# EAGLE design uio_l (EAGLE 6.4)
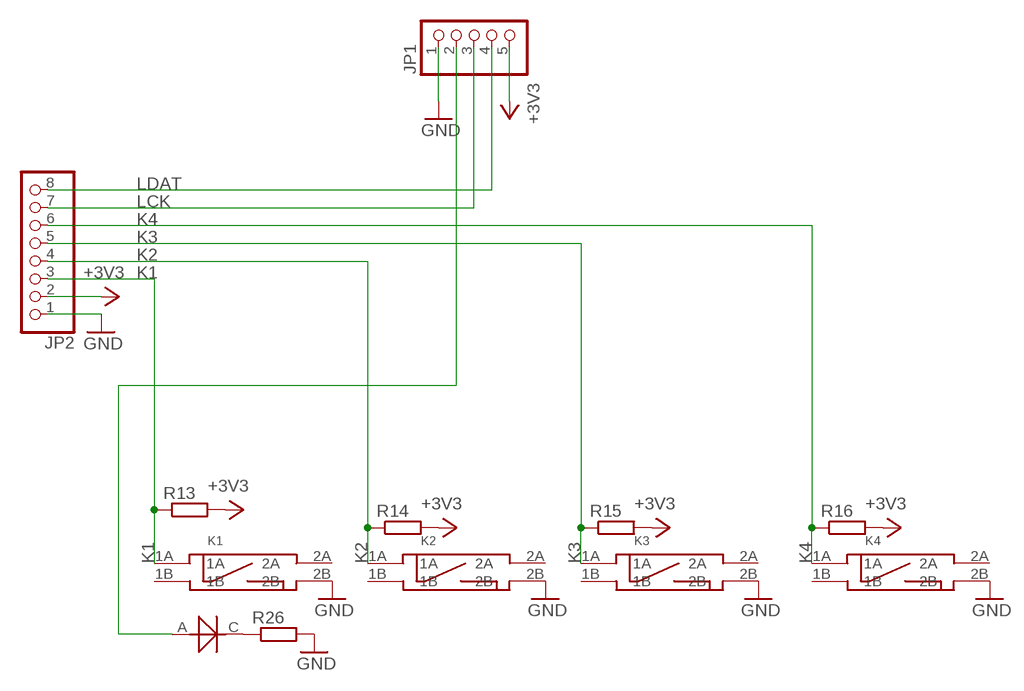
[diagram p0: schematic, sheet 1]

## Parts
JP1  PINHD-1X05_2.54-S  [1X05-S]
JP2  PINHD-1X08_2.54-S  [1X08-S]
K1  SWITCH_BD_B  [SW_SMD2]
K2  SWITCH_BD_B  [SW_SMD2]
K3  SWITCH_BD_B  [SW_SMD2]
K4  SWITCH_BD_B  [SW_SMD2]
R13  R_0805  [R0805]
R14  R_0805  [R0805]
R15  R_0805  [R0805]
R16  R_0805  [R0805]
R26  R_0805  [R0805]
U$14  LED5X2  [LED_5X2]

## Nets
+3V3: JP1.5 JP2.2 R13.2 R14.2 R15.2 R16.2
GND: JP1.1 JP2.1 K1.2B K2.2B K3.2B K4.2B R26.2
K1: JP2.3 K1.1A R13.1
K2: JP2.4 K2.1A R14.1
K3: JP2.5 K3.1A R15.1
K4: JP2.6 K4.1A R16.1
LCK: JP1.3 JP2.7
LDAT: JP1.4 JP2.8
LED11: JP1.2 U$14.A
N$11: R26.1 U$14.C
Unconnected: K1.1B K1.2A K2.1B K2.2A K3.1B K3.2A K4.1B K4.2A

## Library data of the parts
JP1 = pinhead-2:PINHD-1X05: PIN HEADER
JP2 = pinhead-2:PINHD-1X08: PIN HEADER
K1-K4 = _moja:SWITCH_BD
R13-R16 R26 = _moja:R
U$14 = _moja:LED

## Board
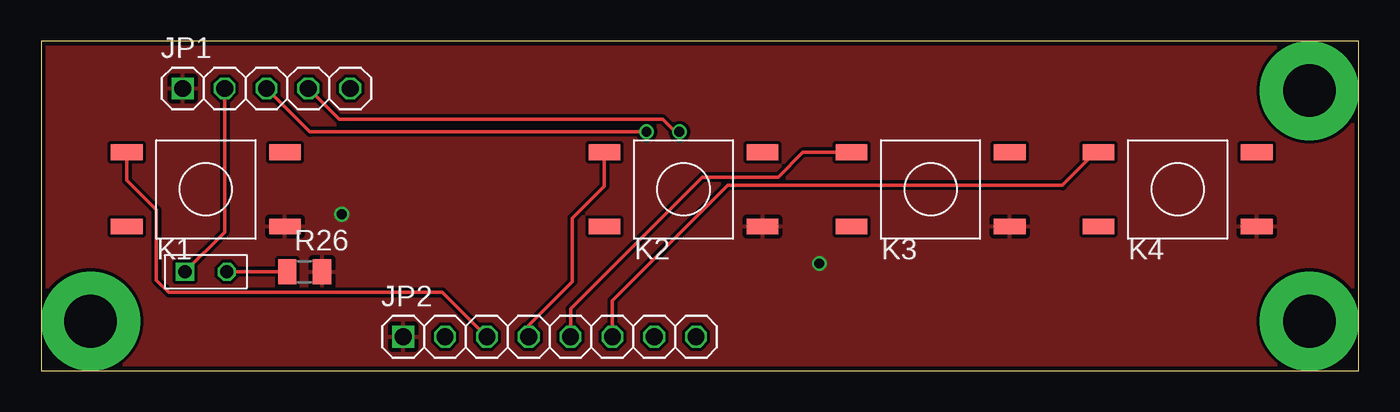
[diagram p1: board, top side]
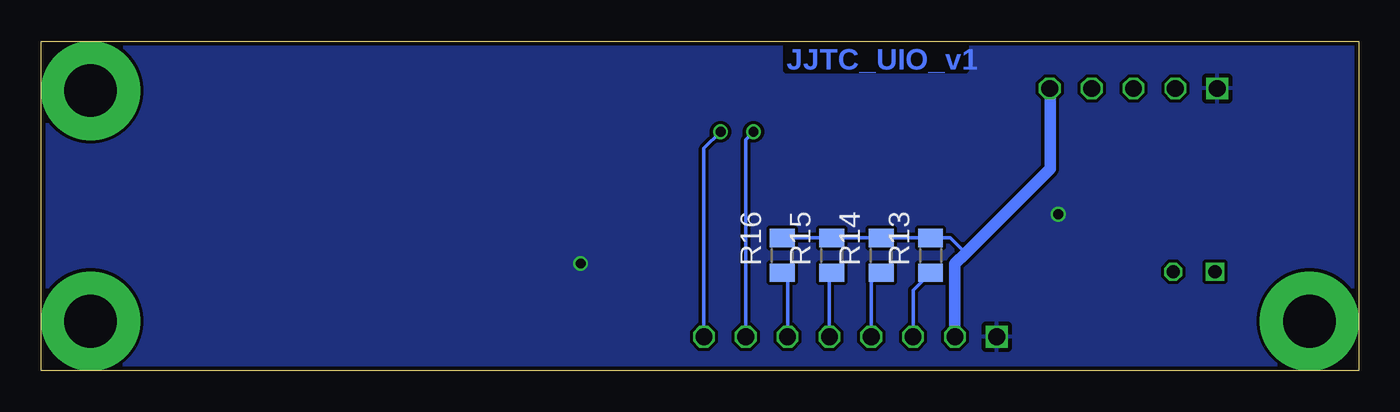
[diagram p2: board, bottom side, seen from below]

Size 80 x 20 mm. Coordinates in mm from the lower left corner, seen from the top.
Outline: 0,0 80,0 80,20 0,20 0,0
Copper layers (1*16): Top 0.035mm / dielectric 1.5mm / Bottom 0.035mm
Design rules "ch_6": minimum track width 0.15mm, minimum drill 0.4mm, track to track 0.2mm, track to pad 0.2mm, pad to pad 0.2mm, via to via 0.2mm, smd to smd 0.2mm, copper to edge 10mil, drill to drill 8mil, minimum pad ring 0.15mm, minimum via ring 0.15mm, stop-mask expansion 4mil, vias tented up to drill 0mil, thermal gap 10mil

### Footprints (pad centres in the part's own frame; a part is rotated, then mirrored left to right if it is on the bottom)
1X05-S = drill 1.016 square: 1 -5.08,0 | drill 1.016 octagon: 2 -2.54,0; 3 0,0; 4 2.54,0; 5 5.08,0
1X08-S = drill 1.016 square: 1 -8.89,0 | drill 1.016 octagon: 2 -6.35,0; 3 -3.81,0; 4 -1.27,0; 5 1.27,0; 6 3.81,0; 7 6.35,0; 8 8.89,0
SW_SMD2 = smd 1.93 x 0.965: 1A -4.8,2.25; 1B -4.8,-2.25; 2A 4.8,2.25; 2B 4.8,-2.25
R0805 = smd 1.1 x 1.5: 1 -1.05,0; 2 1.05,0
LED_5X2 = drill 0.8 square: A -1.27,0 | drill 0.8 octagon: C 1.27,0

### Placement (x,y rotation side)
JP1  13.68,17.13 0 top
JP2  30.87,2.05 0 top
K1  10,11 0 top
K2  39,11 0 top
K3  54,11 0 top
K4  69,11 0 top
R13  26,7 90 bottom
R14  29,7 90 bottom
R15  32,7 90 bottom
R16  35,7 90 bottom
R26  16,6 0 top
U$14  10,6 0 top

### Tracks (layer width: path | path; a pad name or v marks a point on that pad's centre or on a via)
+3V3
  Bottom 0.2: 23.88,7.12 24.8,8.05 R13.2 R14.2 R15.2 R16.2
  Bottom 0.7: JP2.2 24.52,6.48 23.88,7.12 18.75,12.25 JP1.5
GND  (via drill 0.6)
  other vias: 18.25,9.5 47.25,6.5
  pour Bottom: 0,0 80,0 80,20 0,20
  pour Top: 0,0 80,0 80,20 0,20
K1
  Top 0.2: K1.1A 5.2,11.55 7,9.75 7,5.5 7.75,4.75 24.36,4.75 JP2.3
  Bottom 0.2: JP2.3 27.06,4.89 R13.1
K2
  Top 0.2: K2.1A 34.2,11.2 32.25,9.25 32.25,5.4 29.6,2.75 JP2.4
  Bottom 0.2: JP2.4 29.6,5.35 R14.1
K3
  Top 0.2: K3.1A 46.25,13.25 44.75,11.75 40.14,11.75 32.14,3.75 JP2.5
  Bottom 0.2: JP2.5 32.14,5.81 R15.1
K4
  Top 0.2: K4.1A 64,13.25 62,11.25 41.68,11.25 34.68,4.25 JP2.6
  Bottom 0.2: JP2.6 34.68,5.63 R16.1
LCK  (via drill 0.6)
  Top 0.2: v36.75,14.5 16.31,14.5 JP1.3
  Bottom 0.2: JP2.7 37.22,14.03 v36.75,14.5
LDAT  (via drill 0.6)
  Top 0.2: v38.75,14.5 38.5,14.5 37.75,15.25 18.1,15.25 JP1.4
  Bottom 0.2: JP2.8 39.76,13.49 v38.75,14.5
LED11
  Top 0.2: JP1.2 11.14,8.41 U$14.A
N$1  (via drill 3.2 pad 6)
  other vias: 3,3
N$2  (via drill 3.2 pad 6)
  other vias: 77,17
N$3  (via drill 3.2 pad 6)
  other vias: 77,3
N$11
  Top 0.2: R26.1 U$14.C

### Text on the board
Bottom: JJTC_UIO_v1